# EAGLE design LilyPad-Dev-v34 (EAGLE 6.2)

## Sheet 1 of 2
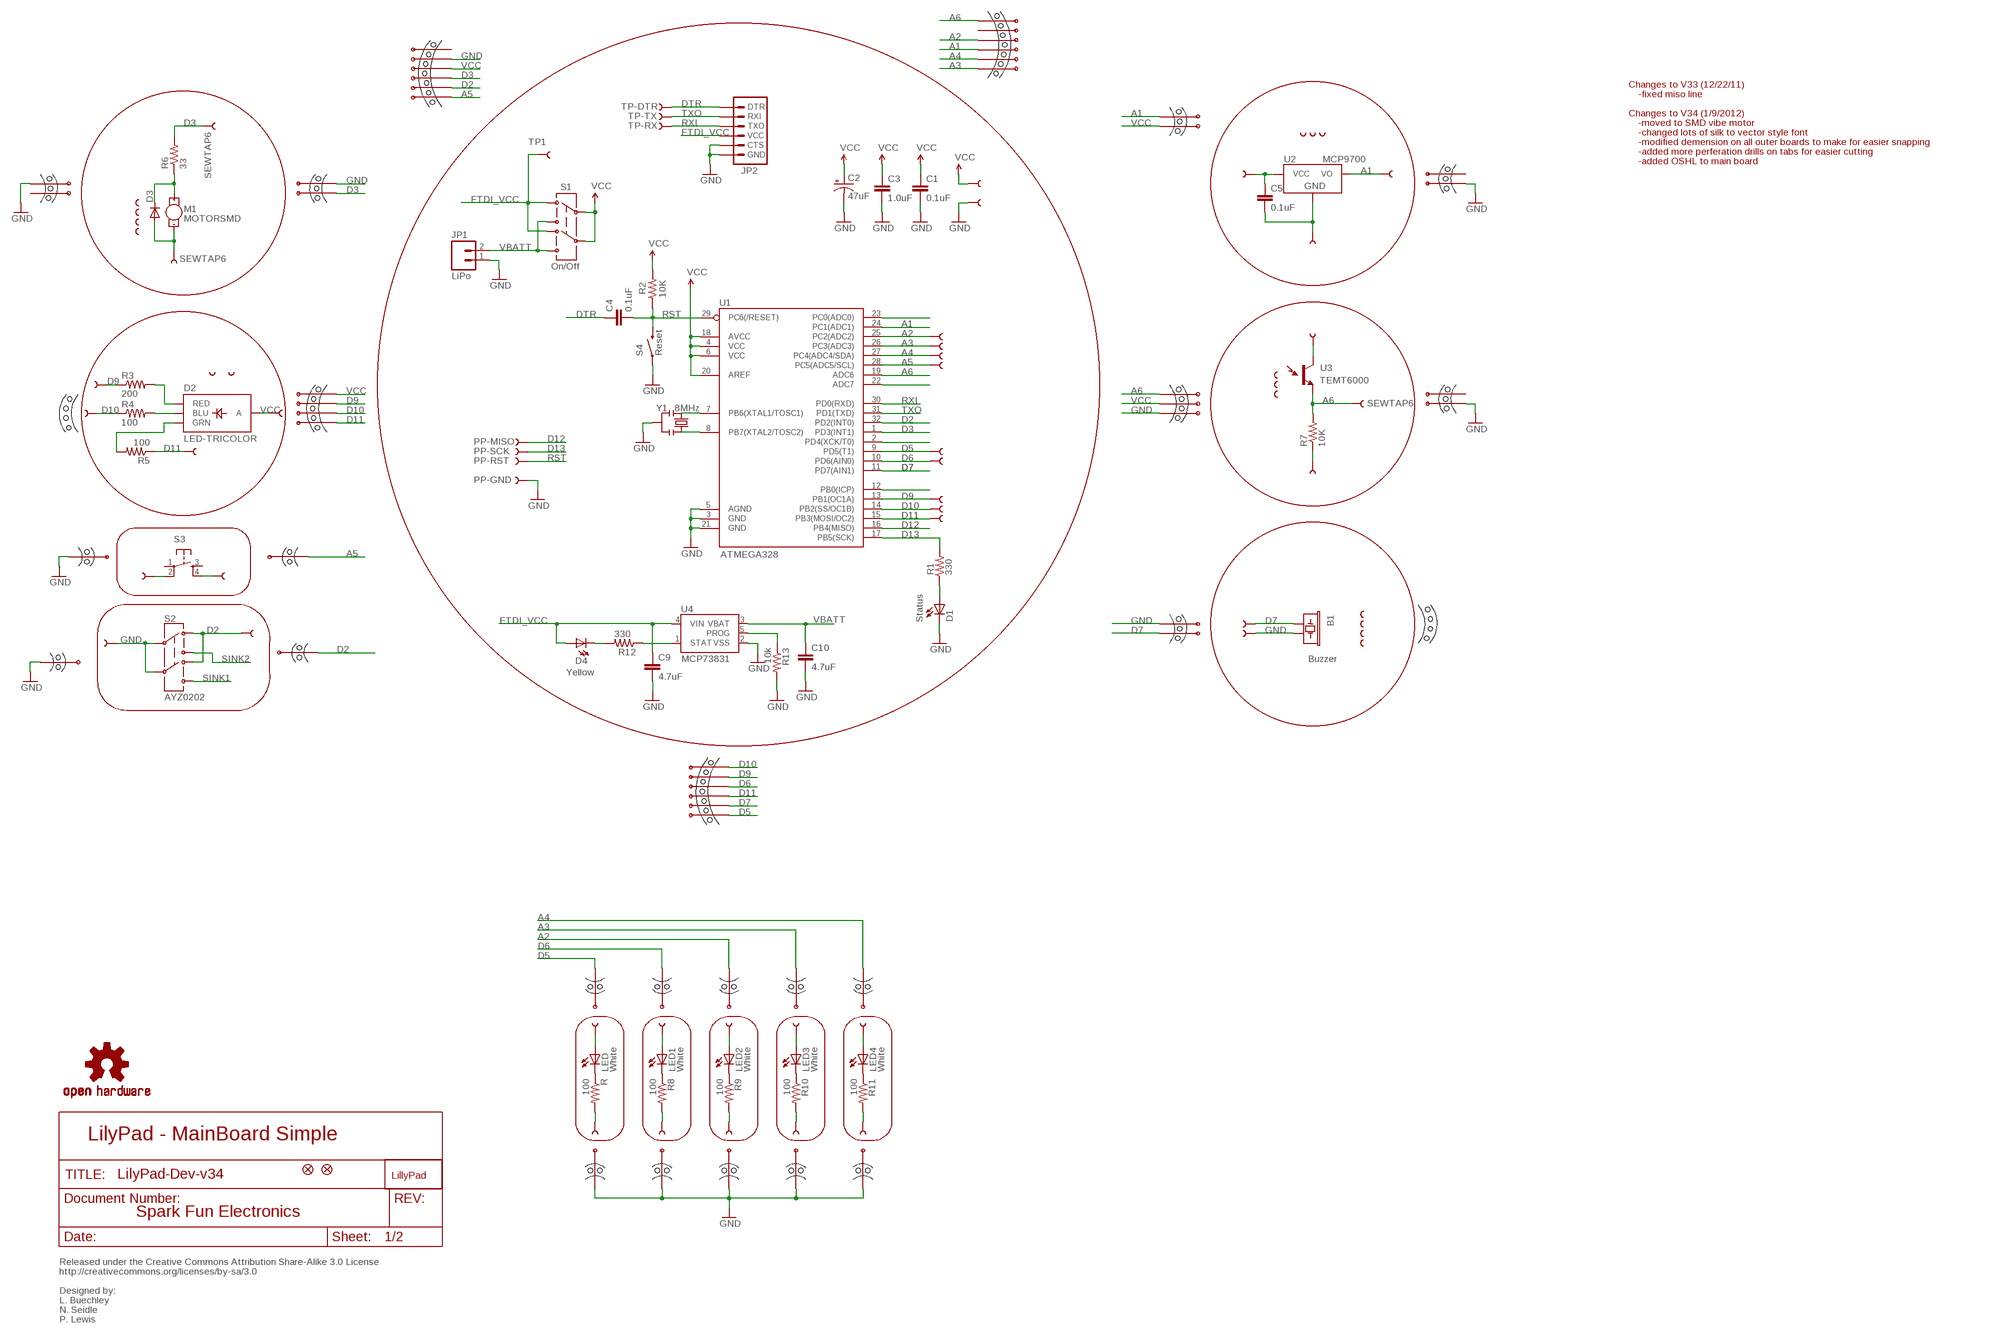
[diagram p0: schematic, sheet 1]

### Parts
1  SEWTAP-NOHOLE2  [PETAL-NOHOLE-2SIDE]
2  SEWTAP-NOHOLE2  [PETAL-NOHOLE-2SIDE]
3  SEWTAP-NOHOLE2  [PETAL-NOHOLE-2SIDE]
4  SEWTAP-NOHOLE2  [PETAL-NOHOLE-2SIDE]
A2/16  SEWTAP9  [PETAL-LONG-1-2SIDE]
A3/17  SEWTAP9  [PETAL-LONG-1-2SIDE]
A4/18  SEWTAP9  [PETAL-LONG-1-2SIDE]
A5/19  SEWTAP9  [PETAL-LONG-1-2SIDE]
B1  Buzzer  BUZZERSMD2  [BUZZER-CCV]
BUTTON-  SEWTAP8  SEWTAP4  [PETAL-SMALL]
BUTTONS  SEWTAP8  SEWTAP4  [PETAL-SMALL]
C1  0.1uF  CAP0402-CAP  [0402-CAP]
C2  47uF  CAP_POL3528  [EIA3528]
C3  1.0uF  CAP0402-CAP  [0402-CAP]
C4  0.1uF  CAP0402-CAP  [0402-CAP]
C5  0.1uF  CAP0603-CAP  [0603-CAP]
C9  4.7uF  CAP0402-CAP  [0402-CAP]
C10  4.7uF  CAP0402-CAP  [0402-CAP]
D1  Status  LED0603  [LED-0603]
D2  LED-TRICOLOR  [LED-TRICOLOR-SMD]
D3  DIODESOD  [SOD-323]
D4  Yellow  LED0603  [LED-0603]
JP1  LiPo  M02-JST-2MM-SMT  [JST-2-SMD]
JP2  ARDUINO_SERIAL_PROGRAMSMD  [1X06-SMD]
JP3  FIDUCIAL1X2  [FIDUCIAL-1X2]
JP4  FIDUCIAL1X2  [FIDUCIAL-1X2]
LED  White  LED1206  [LED-1206]
LED1  White  LED1206  [LED-1206]
LED2  White  LED1206  [LED-1206]
LED3  White  LED1206  [LED-1206]
LED4  White  LED1206  [LED-1206]
LED+  SEWTAP6  [PETAL-SMALL-2SIDE]
LED+1  SEWTAP6  [PETAL-SMALL-2SIDE]
LED+2  SEWTAP6  [PETAL-SMALL-2SIDE]
LED+3  SEWTAP6  [PETAL-SMALL-2SIDE]
LED+4  SEWTAP6  [PETAL-SMALL-2SIDE]
LED-  SEWTAP6  [PETAL-SMALL-2SIDE]
LED-1  SEWTAP6  [PETAL-SMALL-2SIDE]
LED-2  SEWTAP6  [PETAL-SMALL-2SIDE]
LED-3  SEWTAP6  [PETAL-SMALL-2SIDE]
LED-4  SEWTAP6  [PETAL-SMALL-2SIDE]
LIGHT1  SEWTAP-NOHOLE2  [PETAL-NOHOLE-2SIDE]
LIGHT2  SEWTAP-NOHOLE2  [PETAL-NOHOLE-2SIDE]
LIGHT3  SEWTAP-NOHOLE2  [PETAL-NOHOLE-2SIDE]
LIGHT+  SEWTAP6  SEWTAP4  [PETAL-SMALL]
LIGHT-  SEWTAP6  SEWTAP4  [PETAL-SMALL]
LIGHTS  SEWTAP6  SEWTAP4  [PETAL-SMALL]
LOGO  LOGO-LPLPA  [LOGO-LPA]
M1  MOTORSMD  [VIBE-MOTOR-10MM-SMD]
PP-GND  TEST-POINT3X5  [PAD.03X.05]
PP-MISO  TEST-POINT3X5  [PAD.03X.05]
PP-RST  TEST-POINT3X5  [PAD.03X.05]
PP-SCK  TEST-POINT3X5  [PAD.03X.05]
R  100  RESISTOR0603-RES  [0603-RES]
R1  330  RESISTOR0402-RES  [0402-RES]
R2  10K  RESISTOR0402-RES  [0402-RES]
R3  200  RESISTOR0402-RES  [0402-RES]
R4  100  RESISTOR0402-RES  [0402-RES]
R5  100  RESISTOR0402-RES  [0402-RES]
R6  33  RESISTOR0402-RES  [0402-RES]
R7  10K  RESISTOR0402-RES  [0402-RES]
R8  100  RESISTOR0603-RES  [0603-RES]
R9  100  RESISTOR0603-RES  [0603-RES]
R10  100  RESISTOR0603-RES  [0603-RES]
R11  100  RESISTOR0603-RES  [0603-RES]
R12  330  RESISTOR0402-RES  [0402-RES]
R13  10k  RESISTOR0402-RES  [0402-RES]
S1  On/Off  AYZ0202  [AYZ0202]
S2  AYZ0202  [AYZ0202]
S3  TAC_SWITCHSMD  [TACTILE_SWITCH_SMD]
S4  Reset  SWITCH-MOMENTARY-2SMD  [TACTILE_SWITCH_SMD]
SLIDEOFF  SEWTAP8  SEWTAP4  [PETAL-SMALL]
SLIDEON  SEWTAP8  SEWTAP4  [PETAL-SMALL]
TEMP1  SEWTAP-NOHOLE2  [PETAL-NOHOLE-2SIDE]
TEMP2  SEWTAP-NOHOLE2  [PETAL-NOHOLE-2SIDE]
TEMP3  SEWTAP-NOHOLE2  [PETAL-NOHOLE-2SIDE]
TEMP+  SEWTAP6  SEWTAP4  [PETAL-SMALL]
TEMP-  SEWTAP6  SEWTAP4  [PETAL-SMALL]
TEMPS  SEWTAP6  SEWTAP4  [PETAL-SMALL]
TP1  TEST-POINT3X5  [PAD.03X.05]
TP-DTR  TEST-POINT3X5  [PAD.03X.05]
TP-RX  TEST-POINT3X5  [PAD.03X.05]
TP-TX  TEST-POINT3X5  [PAD.03X.05]
U1  ATMEGA328  ATMEGA168  [TQFP32-08]
U2  MCP9700  MCP9700SMD  [SOT23-3]
U3  TEMT6000  [TEMT6000-SEN]
U4  MCP73831  [SOT23-5]
U$1  SEWTAP9  [PETAL-LONG-1-2SIDE]
U$2  MOUSE-BITE-2  [MOUSE-BITE-2]
U$3  MOUSE-BITE-2  [MOUSE-BITE-2]
U$4  SEWTAP9  [PETAL-LONG-1-2SIDE]
U$5  MOUSE-BITE-2  [MOUSE-BITE-2]
U$6  MOUSE-BITE-2  [MOUSE-BITE-2]
U$7  MOUSE-BITE-66  [MOUSE-BITE-6]
U$8  MOUSE-BITE-66  [MOUSE-BITE-6]
U$10  MOUSE-BITE-12_HOLES  [MOUST-BITE-1-(2_HOLES)]
U$11  MOUSE-BITE-12_HOLES  [MOUST-BITE-1-(2_HOLES)]
U$12  MOUSE-BITE-12_HOLES  [MOUST-BITE-1-(2_HOLES)]
U$13  MOUSE-BITE-12_HOLES  [MOUST-BITE-1-(2_HOLES)]
U$14  MOUSE-BITE-12_HOLES  [MOUST-BITE-1-(2_HOLES)]
U$15  MOUSE-BITE-12_HOLES  [MOUST-BITE-1-(2_HOLES)]
U$16  MOUSE-BITE-12_HOLES  [MOUST-BITE-1-(2_HOLES)]
U$17  MOUSE-BITE-12_HOLES  [MOUST-BITE-1-(2_HOLES)]
U$18  MOUSE-BITE-12_HOLES  [MOUST-BITE-1-(2_HOLES)]
U$19  MOUSE-BITE-12_HOLES  [MOUST-BITE-1-(2_HOLES)]
U$20  MOUSE-BITE-4  [MOUSE-BITE-4]
U$22  SEWTAP6  [PETAL-SMALL-2SIDE]
U$23  SEWTAP6  [PETAL-SMALL-2SIDE]
U$24  SEWTAP6  [PETAL-SMALL-2SIDE]
U$25  SEWTAP6  [PETAL-SMALL-2SIDE]
U$26  SEWTAP-NOHOLE2  [PETAL-NOHOLE-2SIDE]
U$27  SEWTAP-NOHOLE2  [PETAL-NOHOLE-2SIDE]
U$32  MOUSE-BITE-2  [MOUSE-BITE-2]
U$32-  SEWTAP6  SEWTAP4  [PETAL-SMALL]
U$33  MOUSE-BITE-3  [MOUSE-BITE-3]
U$33+  SEWTAP6  SEWTAP4  [PETAL-SMALL]
U$37  SEWTAP9  [PETAL-LONG-1-2SIDE]
U$39  SEWTAP9  [PETAL-LONG-1-2SIDE]
U$40  MOUSE-BITE-12_HOLES  [MOUST-BITE-1-(2_HOLES)]
U$41  SEWTAP9  [PETAL-LONG-1-2SIDE]
U$42  MOUSE-BITE-12_HOLES  [MOUST-BITE-1-(2_HOLES)]
U$43  SEWTAP9  [PETAL-LONG-1-2SIDE]
U$44  MOUSE-BITE-12_HOLES  [MOUST-BITE-1-(2_HOLES)]
U$45  SEWTAP9  [PETAL-LONG-1-2SIDE]
U$46  MOUSE-BITE-12_HOLES  [MOUST-BITE-1-(2_HOLES)]
U$47  MOUSE-BITE-2  [MOUSE-BITE-2]
U$48  MOUSE-BITE-3(NO_PADS)  [MOUSE-BITE-3(NO_PADS)]
U$49  MOUSE-BITE-3(NO_PADS)  [MOUSE-BITE-3(NO_PADS)]
U$51  MOUSE-BITE-66  [MOUSE-BITE-6]
U$52  OSHW-LOGOS  [OSHW-LOGO-S]
VIBE1  SEWTAP-NOHOLE2  [PETAL-NOHOLE-2SIDE]
VIBE2  SEWTAP-NOHOLE2  [PETAL-NOHOLE-2SIDE]
VIBE3  SEWTAP-NOHOLE2  [PETAL-NOHOLE-2SIDE]
VIBE4  SEWTAP-NOHOLE2  [PETAL-NOHOLE-2SIDE]
VIBE+  SEWTAP6  SEWTAP4  [PETAL-SMALL]
VIBE-  SEWTAP6  SEWTAP4  [PETAL-SMALL]
Y1  8MHz  RESONATORSMD  [RESONATOR-SMD]

### Nets
A1: TEMPS.1 U1.24(PC1(ADC1)) U2.2(VO) U$2.P$1 U$7.P$4
A2: A2/16.1 U1.25(PC2(ADC2)) U$7.P$3 U$12.P$1
A3: A3/17.1 U1.26(PC3(ADC3)) U$7.P$6 U$13.P$1
A4: A4/18.1 U1.27(PC4(ADC4/SDA)) U$7.P$5 U$14.P$1
A5: A5/19.1 BUTTONS.1 S3.2 U1.28(PC5(ADC5/SCL)) U$8.P$1 U$40.P$1
A6: LIGHTS.1 R7.2 U1.19(ADC6) U3.EMITTER(E1) U$7.P$1 U$33.P$1
BLU: D2.B(BLU) R4.2
D2: S2.3 S2.6 SLIDEON.1 U1.32(PD2(INT0)) U$8.P$2 U$46.P$1
D3: R6.2 U1.1(PD3(INT1)) U$5.P$1 U$8.P$3 VIBE+.1
D5: U1.9(PD5(T1)) U$10.P$1 U$41.1 U$51.P$1
D6: U1.10(PD6(AIN0)) U$1.1 U$11.P$1 U$51.P$4
D7: B1.+ U1.11(PD7(AIN1)) U$32.P$2 U$33+.1 U$51.P$2
D9: R3.1 U1.13(PB1(OC1A)) U$20.P$3 U$22.1 U$37.1 U$51.P$5
D10: R4.1 U1.14(PB2(SS/OC1B)) U$20.P$2 U$24.1 U$39.1 U$51.P$6
D11: R5.1 U1.15(PB3(MOSI/OC2)) U$4.1 U$20.P$1 U$23.1 U$51.P$3
D12: PP-MISO.P$1 U1.16(PB4(MISO))
D13: PP-SCK.P$1 R1.2 U1.17(PB5(SCK))
DTR: C4.1 JP2.1(DTR) TP-DTR.P$1
FTDI_VCC: C9.1 D4.A JP2.4(VCC) S1.3 S1.6 TP1.P$1 U4.4(VIN)
GND [VCC]: B1.- BUTTON-.1 C1.2 C2.C(-) C3.2 C5.2 C9.2 C10.2 D1.C D3.2(A) JP1.1 JP2.5(CTS) JP2.6(GND) LIGHT-.1 M1.P$2(-) PP-GND.P$1 R7.1 R13.2 S2.2 S2.5 S3.4 S4.1 SLIDEOFF.1 TEMP-.1 U1.3(GND) U1.5(AGND) U1.21(GND) U2.3(GND) U4.2(VSS) U$3.P$1 U$5.P$2 U$6.P$1 U$8.P$5 U$15.P$1 U$16.P$1 U$17.P$1 U$18.P$1 U$19.P$1 U$32-.1 U$32.P$1 U$33.P$3 U$42.P$1 U$43.1 U$44.P$1 U$47.P$1 VIBE-.1 Y1.2
GRN: D2.G(GRN) R5.2
N$1: U1.7(PB6(XTAL1/TOSC1)) Y1.1
N$2: D1.A R1.1
N$3: U1.8(PB7(XTAL2/TOSC2)) Y1.3
N$5: U1.23(PC0(ADC0))
N$8: U1.22(ADC7)
N$10: D3.1(C) M1.P$1(+) R6.1
N$12: U1.2(PD4(XCK/T0))
N$14: U1.12(PB0(ICP))
N$18: LED.C R.1
N$19: LED+.1 LED.A
N$20: LED-.1 R.2
N$21: LED1.C R8.1
N$22: LED1.A LED+1.1
N$23: LED-1.1 R8.2
N$24: LED2.C R9.1
N$25: LED2.A LED+2.1
N$26: LED-2.1 R9.2
N$27: LED3.C R10.1
N$28: LED3.A LED+3.1
N$29: LED-3.1 R10.2
N$30: LED4.C R11.1
N$31: LED4.A LED+4.1
N$32: LED-4.1 R11.2
N$33: D4.C R12.2
PROG: R13.1 U4.5(PROG)
RED: D2.R(RED) R3.2
RST: C4.2 PP-RST.P$1 R2.1 S4.3 U1.29(PC6(/RESET))
RXI: JP2.3(TXO) TP-RX.P$1 U1.30(PD0(RXD))
SINK1: S2.4
SINK2: S2.1
STAT: R12.1 U4.1(STAT)
TXO: JP2.2(RXI) TP-TX.P$1 U1.31(PD1(TXD))
VBATT: C10.1 JP1.2 S1.1 S1.4 U4.3(VBAT)
VCC [VCC]: C1.1 C2.A(+) C3.1 C5.1 D2.A LIGHT+.1 R2.2 S1.2 S1.5 TEMP+.1 U1.4(VCC) U1.6(VCC) U1.18(AVCC) U1.20(AREF) U2.1(VCC) U3.COLLECTOR(C1) U$2.P$2 U$8.P$4 U$20.P$4 U$25.1 U$33.P$2 U$45.1
Unconnected: S3.1 S3.3 U$3.P$2 U$6.P$2 U$7.P$2 U$8.P$6 U$47.P$2

### Notes on the sheet
- Changes to V33 (12/22/11)
- -fixed miso line
- Changes to V34 (1/9/2012)
- -moved to SMD vibe motor
- -changed lots of silk to vector style font
- -modified demension on all outer boards to make for easier snapping
- -added more perferation drills on tabs for easier cutting
- -added OSHL to main board
- LilyPad - MainBoard Simple
- Spark Fun Electronics
- Released under the Creative Commons Attribution Share-Alike 3.0 License
- http://creativecommons.org/licenses/by-sa/3.0
- Designed by:
- L. Buechley
- N. Seidle
- P. Lewis

## Sheet 2 of 2
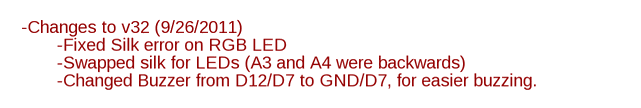
[diagram p1: schematic, sheet 2]

### Notes on the sheet
- -Changes to v32 (9/26/2011)
- -Fixed Silk error on RGB LED
- -Swapped silk for LEDs (A3 and A4 were backwards)
- -Changed Buzzer from D12/D7 to GND/D7, for easier buzzing.

## Library data of the parts
1-4 LIGHT1-LIGHT3 TEMP1-TEMP3 U$26 U$27 VIBE1-VIBE4 = LilyPad-Wearables:SEWTAP-NOHOLE
A2/16 A3/17 A4/18 A5/19 BUTTON- BUTTONS LED+ LED+1-LED+4 LED- LED-1-LED-4 LIGHT+ LIGHT- LIGHTS SLIDEOFF SLIDEON TEMP+ TEMP- TEMPS U$1 U$4 U$22-U$25 U$32- U$33+ U$37 U$39 U$41 U$43 U$45 VIBE+ VIBE- = LilyPad-Wearables:SEWTAP
B1 = SparkFun:BUZZER: Buzzer 12mm Spark Fun Electronics SKU : Comp-Buzzer
C1 C3-C5 C9 C10 = SparkFun:CAP: Capacitor Standard 0603 ceramic capacitor, and 0.1" leaded capacitor.
C2 = SparkFun:CAP_POL: Capacitor Polarized These are standard SMD and PTH capacitors. Normally 10uF, 47uF, and 100uF in electrolytic and tantalum varieties. Always verify the external diameter of the through hole cap, it varies with capacity, voltage, and manufacturer. The EIA devices should be standard.
D1 D4 = SparkFun:LED: LEDs
D2 = SparkFun:LED-TRICOLOR: Tri-Color LED SMD Proven layout and schematic for triple color LED in SMD package - common anode. Spark Fun Electronics SKU : COM-07844
D3 = SparkFun:DIODE: Diode These are standard reverse protection diodes and small signal diodes. SMA package can handle up to about 1A. SOD-323 can handle about 200mA. What the SOD-323 package when ordering, there are some mfgs out there that are 5-pin packages.
JP1 = SparkFun:M02: Header 2 Standard 2-pin 0.1" header. Use with straight break away headers (SKU : PRT-00116), right angle break away headers (PRT-00553), swiss pins (PRT-00743), machine pins (PRT-00117), and female headers (PRT-00115). Molex polarized connector foot print use with SKU : PRT-08233 with associated crimp pins and housings.
JP2 = SparkFun:ARDUINO_SERIAL_PROGRAM
JP3 JP4 = SparkFun:FIDUCIAL: Fiducial Alignment Points Various fiducial points for machine vision alignment.
LED LED1-LED4 = SparkFun-3-2-07:LED: LEDs
LOGO = LilyPad-Wearables:LOGO-LP
M1 = Testing:MOTOR: Vibration Motor Physical dimension and wire connections for this powerful vibration motor. Motor has a self adhesive backing. Spark Fun Electronics SKU : ROB-08449
PP-GND PP-MISO PP-RST PP-SCK TP1 TP-DTR TP-RX TP-TX = SparkFun:TEST-POINT
R R1-R13 = SparkFun:RESISTOR: Resistor Basic schematic elements and footprints for 0603, 1206, and PTH resistors.
S1 S2 = SparkFun:AYZ0202: SPDT Slide Switch Simple SMD single-pull double-throw slide switch. Good for less than 350mA power switch, switching UARTs between devices, etc. Spark Fun Electronics SKU : COM-00597
S3 = SparkFun:TAC_SWITCH: Momentary Switch Button commonly used for reset or general input. Spark Fun Electronics SKU : COM-00097
S4 = SparkFun:SWITCH-MOMENTARY-2
U1 = SparkFun:ATMEGA168
U2 = SparkFun:MCP9700
U3 = SparkFun:TEMT6000: Ambient Light Sensor Simple light detection sensor. Output varies with light intensity input. Spark Fun Electronics SKU : COM-08348
U4 = SparkFun:MCP73831: Microchip's MCP73831 Miniature single cell, fully integrated Li-Ion, Li-polymer charge management controller http://ww1.microchip.com/downloads/en/DeviceDoc/21984a.pdf
U$2 U$3 U$5 U$6 U$32 U$47 = Testing:MOUSE-BITE-2
U$7 U$8 U$51 = Testing:MOUSE-BITE-6
U$10-U$19 U$40 U$42 U$44 U$46 = Testing:MOUSE-BITE-1
U$20 = Testing:MOUSE-BITE-4
U$33 = Testing:MOUSE-BITE-3
U$48 U$49 = Testing:MOUSE-BITE-3(NO_PADS)
U$52 = SparkFun:OSHW-LOGO: Open Source Hardware Logo This logo indicates the piece of hardware it is found on incorporates a OSHW license and/or adheres to the definition of open source hardware found here: http://freedomdefined.org/OSHW
Y1 = SparkFun:RESONATOR: Resonator Small SMD resonator. This is the itty bitty 10/20MHz resonators with built in caps. CSTCE10M0G55 and CSTCE20M0V53. Footprint has been reviewed closely but hasn't been tested yet.

## Net classes
1 VCC: width 0.203 mm

## Board
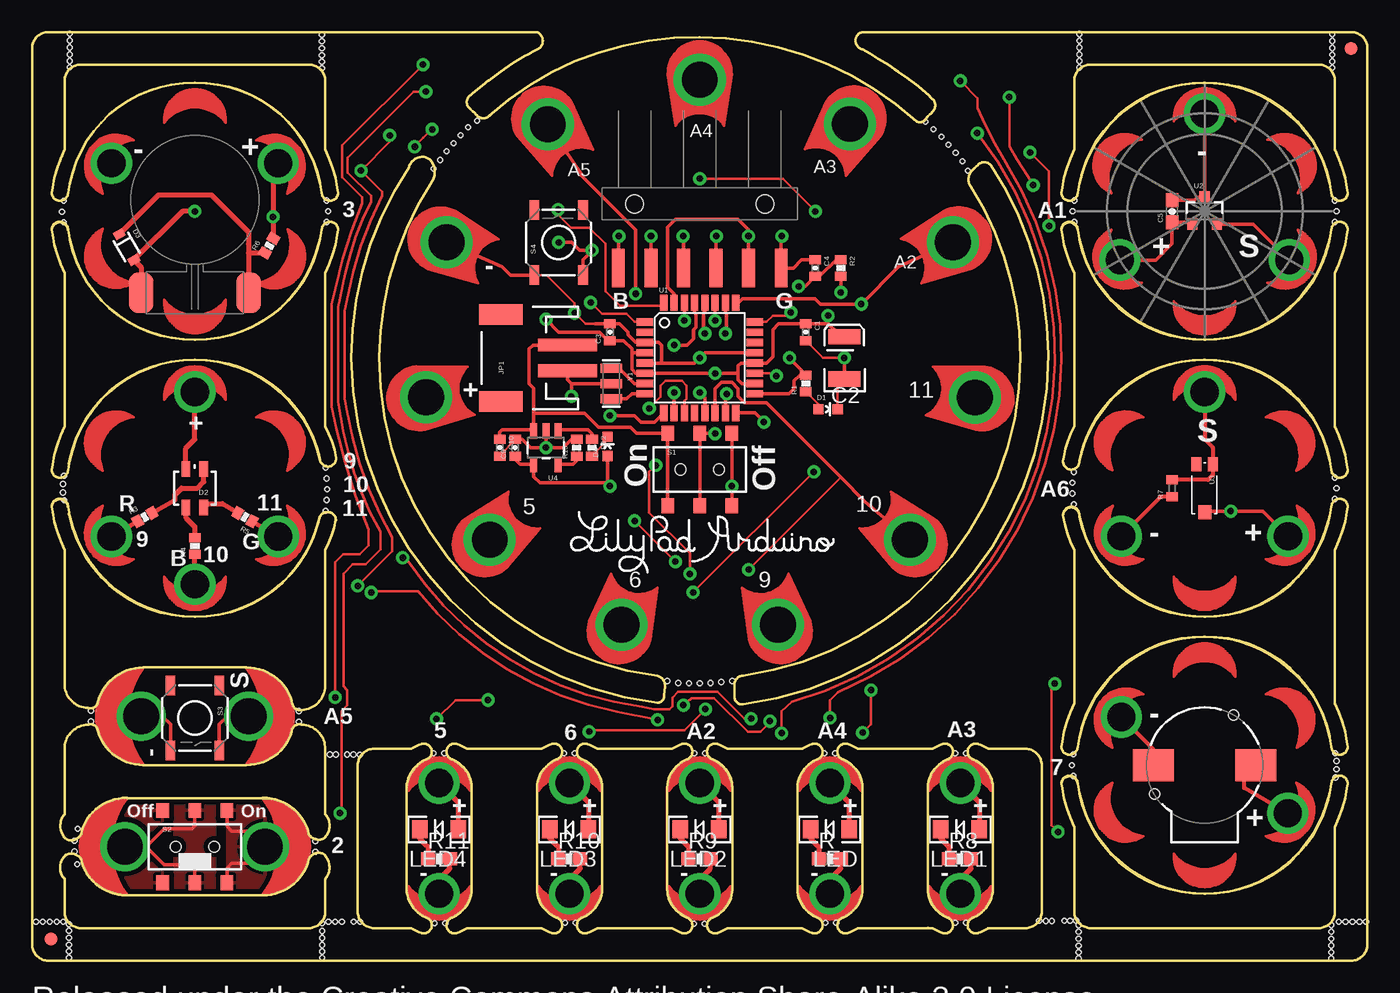
[diagram p2: board, top side]
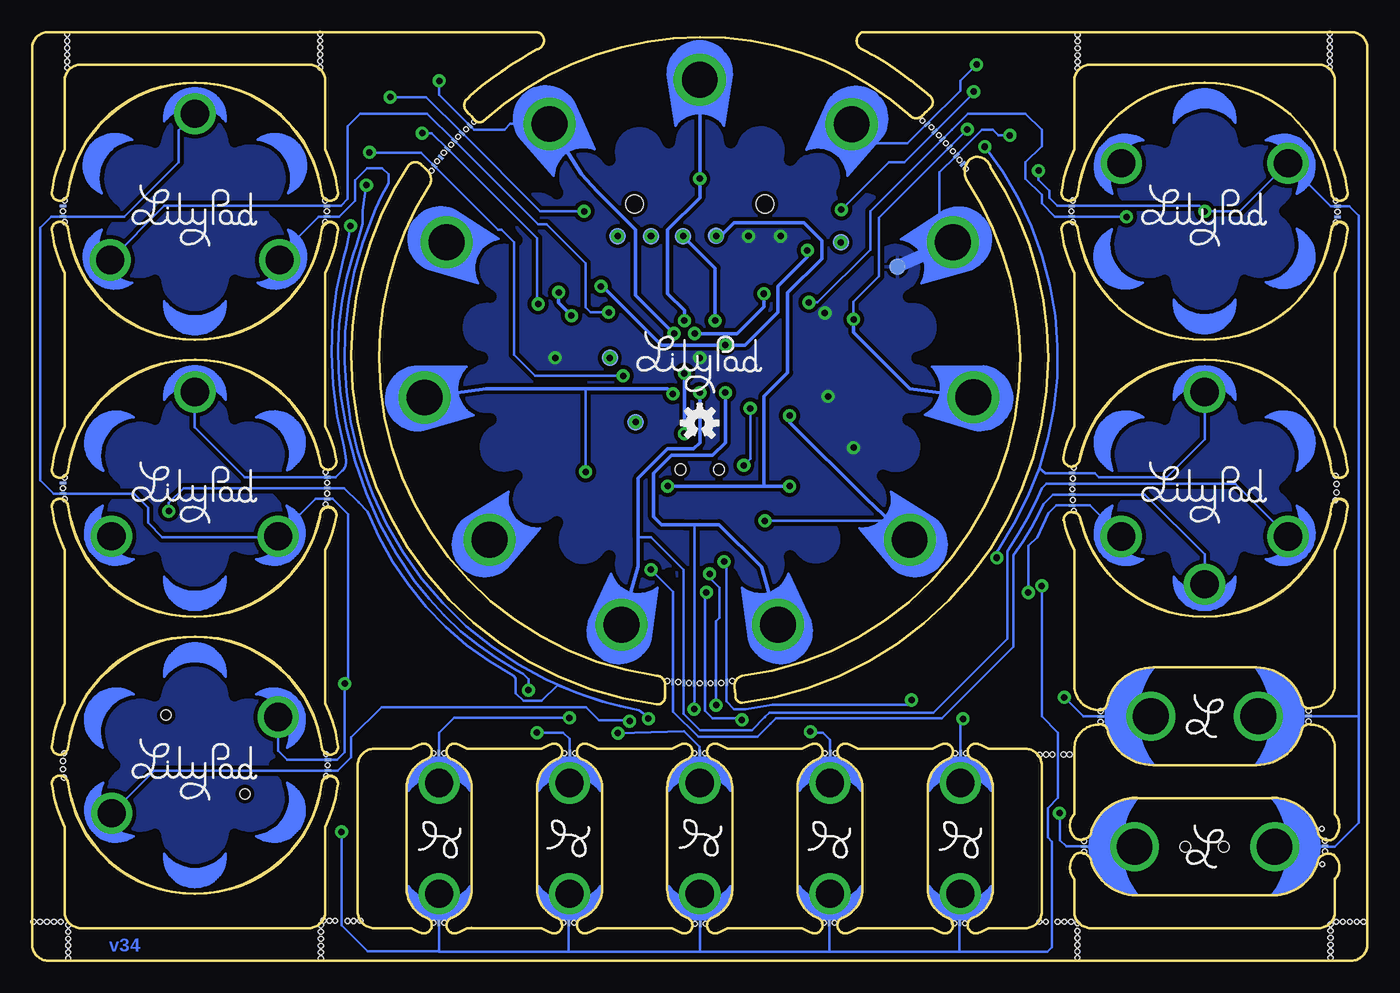
[diagram p3: board, bottom side, seen from below]

Size 104.14 x 72.39 mm. Coordinates in mm from the lower left corner, seen from the top.
Outline: 543 segments
Copper layers (1*16): Top 0.035mm / dielectric 1.5mm / Bottom 0.035mm
Design rules: minimum track width 6mil, minimum drill 15mil, track to track 8mil, track to pad 8mil, pad to pad 8mil, via to via 8mil, smd to smd 8mil, copper to edge 10mil, drill to drill 8mil, minimum pad ring 12mil, minimum via ring 10mil, stop-mask expansion 4mil, vias tented up to drill 20mil, thermal gap 10mil
Holes 0.38 mm at 3.56,10.29 3.53,7.52 2.89,2.85 2.89,2.33 2.89,1.79 2.89,1.24 2.89,0.74 2.89,0.24 22.62,2.91 22.63,2.31 22.63,1.77 22.63,1.22 22.63,0.71 22.63,0.22 2.94,72.25 2.94,71.73 2.94,71.19 2.94,70.64 2.94,70.14 2.94,69.64 22.61,72.19 22.61,71.67 22.61,71.13 22.61,70.58 22.61,70.07 22.61,69.58 81.62,2.77 81.62,2.25 81.62,1.71 81.62,1.17 81.62,0.66 81.62,0.16 101.32,2.78 101.32,2.26 101.32,1.72 101.32,1.18 101.32,0.67 101.32,0.17 81.68,72.25 81.68,71.72 81.68,71.18 81.68,70.64 81.68,70.13 81.68,69.63 101.39,72.21 101.39,71.69 101.39,71.15 101.39,70.61 101.39,70.1 101.39,69.6 25.58,3.03 25.08,3.02 24.17,3.02 23.64,3.03 23.11,3.04 81.41,3.14 80.96,3.12 80.49,3.11 79.06,3.09 78.54,3.11 79.53,3.1 102.44,3.04 102.98,3.04 103.52,3.04 104.03,3.04 101.91,3.04 0.84,3.04 1.38,3.04 1.92,3.04 2.43,3.04 0.31,3.04 25.57,16.06 25.05,16.07 25.05,16.07 24.58,16.07 23.69,16.08 23.22,16.07
bRestrict: area 29.5,24.4 to 74.6,69.6; area 48.1,64.8 to 50.6,66; area 58.7,63.3 to 61.5,65; area 63.4,60.4 to 66,62.7; area 67.1,56.1 to 69.1,58.9; area 69.3,51.2 to 70.7,53.8; area 69.9,45.9 to 71.1,48.2; area 69.3,40.2 to 70.8,42.9; area 63.4,31.4 to 66.1,33.7; area 58.8,29 to 61.6,30.7; area 53.6,28 to 56,29.3; area 48.2,28 to 50.7,29.3; 11 more areas; 22 lines

### Footprints (pad centres in the part's own frame; a part is rotated, then mirrored left to right if it is on the bottom)
PETAL-LONG-1-2SIDE = drill 2.794 pad 4.064: 1 0.03,0
BUZZER-CCV = smd 3.2 x 2.5: + 4,0; - -4,0 | hole 0.8: -3.9,-2.25; 2.25,3.9
PETAL-MEDIUM-2SIDE = drill 2.794: 1 0,-0.254
0402-CAP = smd 0.7 x 0.9: 1 -0.65,0; 2 0.65,0
EIA3528 = smd 1.2 x 2.5: A 1.65,0; C -1.65,0
0603-CAP = smd 1.1 x 1: 1 -0.85,0; 2 0.85,0
LED-0603 = smd 0.8 x 0.8: A 0,-0.75; C 0,0.75
LED-TRICOLOR-SMD = smd 0.7 x 1.2: A 0.7,-1.5; B 0.7,1.5; G -0.7,1.5; R -0.7,-1.5
SOD-323 = smd 0.63 x 0.83: 1 -1.15,0; 2 1.15,0
JST-2-SMD = smd 1 x 4.6: 1 -1,-3.7; 2 1,-3.7 | smd 1.6 x 3.4: NC1 -3.4,1.5; NC2 3.4,1.5
1X06-SMD = smd 1 x 3: 1 -6.35,5; 2 -3.81,5; 3 -1.27,5; 4 1.27,5; 5 3.81,5; 6 6.35,5 | hole 1.4: -5.08,0; 5.08,0
FIDUCIAL-1X2 = smd 1 x 1: 1 0,0
LED-1206 = smd 1.2 x 1.4: A -1.5,0; C 1.5,0
PETAL-SMALL-2SIDE = drill 2.2: 1 0,0
VIBE-MOTOR-10MM-SMD = smd 1.905 x 3.175: P$1 4.191,-7.239; P$2 -4.191,-7.239
PAD.03X.05 = smd 1.27 x 1.27: P$1 0,0
0603-RES = smd 1.1 x 1: 1 -0.85,0; 2 0.85,0
0402-RES = smd 0.7 x 0.9: 1 -0.65,0; 2 0.65,0
C0402 = smd 0.7 x 0.9: 1 -0.65,0; 2 0.65,0
AYZ0202 = smd 1 x 1.15: 1 -2.5,2.825; 2 0,2.825; 3 2.5,2.825; 4 -2.5,-2.825; 5 0,-2.825; 6 2.5,-2.825 | hole 0.85: 1.5,0; -1.5,0
TACTILE_SWITCH_SMD = smd 1.524 x 0.762: 1 -2.54,1.905; 2 2.54,1.905; 3 -2.54,-1.905; 4 2.54,-1.905
TQFP32-08 = smd 1.27 x 0.559: 1 -4.293,2.8; 2 -4.293,2; 3 -4.293,1.2; 4 -4.293,0.4; 5 -4.293,-0.4; 6 -4.293,-1.2; 7 -4.293,-2; 8 -4.293,-2.8; 17 4.293,-2.8; 18 4.293,-2; 19 4.293,-1.2; 20 4.293,-0.4; 21 4.293,0.4; 22 4.293,1.2; 23 4.293,2; 24 4.293,2.8 | smd 0.559 x 1.27: 9 -2.8,-4.293; 10 -2,-4.293; 11 -1.2,-4.293; 12 -0.4,-4.293; 13 0.4,-4.293; 14 1.2,-4.293; 15 2,-4.293; 16 2.8,-4.293; 25 2.8,4.293; 26 2,4.293; 27 1.2,4.293; 28 0.4,4.293; 29 -0.4,4.293; 30 -1.2,4.293; 31 -2,4.293; 32 -2.8,4.293
SOT23-3 = smd 0.8 x 0.9: 1 -0.95,-1; 2 0.95,-1; 3 0,1.1
TEMT6000-SEN = smd 1.1 x 0.8: BASE -1.87,-0.65; EMITTER -1.87,0.65 | smd 1.1 x 1: COLLECTOR 1.86,0.01
SOT23-5 = smd 0.55 x 1.2: 1 -0.95,-1.3; 2 0,-1.3; 3 0.95,-1.3; 4 0.95,1.3; 5 -0.95,1.3
MOUSE-BITE-2 = smd 0.203 x 0.508 bottom: P$1 -0.419,0; P$2 0.419,0 | hole 0.381: -0.838,0.127; 0,0; 0.838,0.127
MOUSE-BITE-6 = smd 0.203 x 0.508 bottom: P$1 -2.095,0.089; P$2 -1.257,0.038; P$3 -0.419,0; P$4 0.419,0; P$5 1.257,0.038; P$6 2.095,0.114 | hole 0.381: -2.527,0.191; -1.676,0.025; -0.838,0; 0,0; 0.838,0.025; 1.676,0.102; 2.527,0.191
MOUST-BITE-1-(2_HOLES) = smd 0.203 x 0.508 bottom: P$1 -0.013,0 | hole 0.381: -0.432,0; 0.406,0
MOUSE-BITE-4 = smd 0.203 x 0.508 bottom: P$1 -1.257,0; P$2 -0.419,0; P$3 0.419,0; P$4 1.257,0 | hole 0.381: -1.676,0.127; -0.838,0.051; 0,0; 0.838,0.051; 1.676,0.127
MOUSE-BITE-3 = smd 0.203 x 0.508 bottom: P$1 -0.851,0; P$2 -0.013,0; P$3 0.826,0 | hole 0.381: -1.27,0.127; -0.432,0; 0.406,0; 1.245,0.127
MOUSE-BITE-3(NO_PADS) = hole 0.381: -0.965,0.076; -0.33,0; 0.33,0; 0.94,0.102
RESONATOR-SMD = smd 0.7 x 1.7: 1 -1.2,0; 2 0,0; 3 1.2,0

### Placement (x,y rotation side)
1  91.44,22.74 180 top
2  97.94,18.99 120 top
3  91.44,7.74 0 top
4  84.94,11.49 300 top
A2/16  71.84,56.03 204.5 top
A3/17  63.81,65.25 237.3 top
A4/18  52.07,68.69 270 top
A5/19  40.2,65.23 302.7 top
B1  91.44,15.24 0 top
BUTTON-  SEWTAP8  [PETAL-MEDIUM-2SIDE]  8.76,19.05 270 top
BUTTONS  SEWTAP8  [PETAL-MEDIUM-2SIDE]  16.64,19.05 90 top
C1  60.34,48.99 270 top
C2  63.34,46.99 90 top
C3  45.07,48.99 90 top
C4  61.07,53.99 270 top
C5  88.9,58.42 90 top
C9  37.67,39.99 90 top
C10  36.47,39.99 270 top
D1  62.07,42.99 270 top
D2  12.7,36.83 180 top
D3  7.37,55.63 300 top
D4  44.87,40.09 0 top
JP1  38.07,46.99 90 top
JP2  52.07,58.99 180 top
JP3  102.87,71.12 0 top
JP4  1.47,1.68 0 top
LED  62.21,10.24 180 top
LED1  72.37,10.24 180 top
LED2  52.05,10.24 180 top
LED3  41.89,10.24 180 top
LED4  31.73,10.24 180 top
LED+  62.23,13.84 180 top
LED+1  72.39,13.84 180 top
LED+2  52.07,13.84 180 top
LED+3  41.91,13.84 180 top
LED+4  31.75,13.84 180 top
LED-  62.23,5.21 0 top
LED-1  72.39,5.21 0 top
LED-2  52.07,5.21 0 top
LED-3  41.91,5.21 0 top
LED-4  31.75,5.21 0 top
LIGHT1  84.94,40.59 240 top
LIGHT2  91.44,29.34 0 top
LIGHT3  97.93,40.58 120 top
LIGHT+  SEWTAP6  [PETAL-SMALL-2SIDE]  97.94,33.08 60 top
LIGHT-  SEWTAP6  [PETAL-SMALL-2SIDE]  84.95,33.08 300 top
LIGHTS  SEWTAP6  [PETAL-SMALL-2SIDE]  91.44,44.33 180 top
LOGO  52.07,32.99 0 top
LOGO1  LOGO-LPL  [LOGO-L]  12.7,8.89 0 bottom
LOGO2  LOGO-LPL  [LOGO-L]  12.7,19.05 0 bottom
LOGO3  LOGO-LPL  [LOGO-L]  62.31,9.53 90 bottom
LOGO4  LOGO-LPL  [LOGO-L]  72.34,9.42 90 bottom
LOGO5  LOGO-LPL  [LOGO-L]  51.99,9.58 90 bottom
LOGO6  LOGO-LPL  [LOGO-L]  41.94,9.42 90 bottom
LOGO7  LOGO-LPL  [LOGO-L]  31.72,9.42 90 bottom
M1  12.7,59.31 0 top
PP-GND  36.67,54.09 0 bottom
PP-MISO  57.07,41.99 0 bottom
PP-RST  41.07,55.99 0 bottom
PP-SCK  59.07,46.99 0 bottom
R  62.21,7.95 0 top
R1  60.34,44.99 90 top
R2  63.07,53.99 270 top
R3  8.8,34.58 30 top
R4  12.7,32.33 90 top
R5  16.6,34.58 150 top
R6  18.5,55.74 60 top
R7  10K  [C0402]  88.9,36.83 90 top
R8  72.37,7.95 0 top
R9  52.05,7.95 0 top
R10  41.89,7.95 0 top
R11  31.73,7.95 0 top
R12  43.67,39.99 270 top
R13  42.47,39.99 90 top
S1  52.07,38.29 0 top
S2  12.7,8.89 0 top
S3  12.7,18.92 270 top
S4  41.07,55.99 90 top
SLIDEOFF  SEWTAP8  [PETAL-MEDIUM-2SIDE]  7.49,8.89 270 top
SLIDEON  SEWTAP8  [PETAL-MEDIUM-2SIDE]  17.91,8.89 90 top
TEMP1  84.84,62.22 240 top
TEMP2  91.44,50.82 0 top
TEMP3  98.04,62.22 120 top
TEMP+  SEWTAP6  [PETAL-SMALL-2SIDE]  84.84,54.62 300 top
TEMP-  SEWTAP6  [PETAL-SMALL-2SIDE]  91.44,66.02 180 top
TEMPS  SEWTAP6  [PETAL-SMALL-2SIDE]  98.04,54.62 60 top
TP1  50.8,56.52 0 bottom
TP-DTR  58.47,56.49 0 bottom
TP-RX  53.37,56.49 0 bottom
TP-TX  55.87,56.49 90 bottom
U1  52.07,46.99 0 top
U2  91.44,58.42 0 top
U3  91.44,36.83 270 top
U4  40.07,39.99 180 top
U$1  45.96,26.16 73.7 top
U$2  81.15,58.42 270 top
U$3  101.73,58.42 90 top
U$4  73.55,43.9 171.8 top
U$5  23.09,58.42 90 top
U$6  101.73,36.83 90 top
U$7  71.47,63.6 131 top
U$8  32.87,63.73 228 top
U$9  [LOGO-LILYPAD]  12.7,36.83 0 bottom
U$10  31.75,16.18 0 top
U$11  41.88,16.18 180 top
U$12  52.04,16.18 180 top
U$13  72.39,16.18 180 top
U$14  62.2,16.18 180 top
U$15  31.83,2.92 0 top
U$16  41.99,2.95 0 top
U$17  52.04,2.87 0 top
U$18  72.42,2.95 0 top
U$19  62.31,2.95 0 top
U$20  23.01,36.75 90 top
U$21  LOGO-LPLP  [LOGO-LILYPAD]  52.07,46.99 0 bottom
U$22  6.2,33.07 300 top
U$23  19.2,33.07 60 top
U$24  12.7,29.34 0 top
U$25  12.7,44.32 180 top
U$26  19.2,40.59 120 top
U$27  6.2,40.59 240 top
U$28  [LILYPAD-BRD-LAYERS-SMALL]  91.44,58.42 0 top
U$29  LOGO-LPLP  [LOGO-LILYPAD]  12.7,58.42 0 bottom
U$30  LOGO-LPLP  [LOGO-LILYPAD]  91.44,58.42 0 bottom
U$31  LOGO-LPLP  [LOGO-LILYPAD]  91.44,36.83 0 bottom
U$32  81.08,15.24 270 top
U$32-  SEWTAP6  [PETAL-SMALL-2SIDE]  84.94,18.99 240 top
U$33  81.13,36.83 270 top
U$33+  SEWTAP6  [PETAL-SMALL-2SIDE]  97.93,11.49 60 top
U$34  [LILYPAD-BRD-LAYERS-SMALL]  91.44,36.83 0 top
U$35  LOGO-LPLP  [LOGO-LILYPAD]  91.44,15.24 0 bottom
U$36  [LILYPAD-BRD-LAYERS-SMALL]  91.44,15.24 0 top
U$37  58.18,26.16 106.3 top
U$38  [LILYPAD-BRD-LAYERS-SMALL]  12.7,36.83 0 top
U$39  68.47,32.78 139.1 top
U$40  20.8,19.05 90 top
U$41  35.67,32.78 40.9 top
U$42  4.6,19.05 270 top
U$43  32.3,56.02 335.5 top
U$44  3.3,8.92 270 top
U$45  30.69,43.91 8.2 top
U$46  22.1,8.92 90 top
U$47  2.34,58.39 270 top
U$48  2.41,36.83 270 top
U$49  101.73,15.24 90 top
U$50  [LILYPAD-BRD-LAYERS-SMALL]  12.7,58.42 0 top
U$51  52.07,21.62 0 top
U$52  52.07,41.91 0 bottom
VIBE1  6.2,54.67 300 top
VIBE2  12.7,50.92 0 top
VIBE3  19.23,54.62 60 top
VIBE4  12.7,65.92 180 top
VIBE+  SEWTAP6  [PETAL-SMALL-2SIDE]  19.2,62.17 120 top
VIBE-  SEWTAP6  [PETAL-SMALL-2SIDE]  6.2,62.17 240 top
Y1  45.17,44.99 270 top

### Tracks (layer width: path | path; a pad name or v marks a point on that pad's centre or on a via)
A1  (via drill 0.51)
  Top 0.203: U1.24 57.28,49.79 57.78,50.29 58.93,50.29 v59.18,50.55
  Top 0.254: 92.44,57.42 95.24,57.42 TEMPS.1
  Top 0.406: 92.44,57.42 U2.2
  Bottom 0.203: v59.18,50.55 60.58,50.55 60.96,50.93 60.96,54.36 64.01,57.4 64.68,57.4 U$7.P$4 73.32,66.04 78.54,66.04 79.52,65.07 79.52,59.38 80.05,58.85 80.52,58.85 U$2.P$1 93.82,58.84 TEMPS.1
A2  (via drill 0.51)
  Top 0.203: v73.71,64.52 arc-113 59.26,20.19 58.45,19.46 v58.45,17.73
  Top 0.254: A2/16.1 67.57,54.09 v64.67,51.19 61.48,51.19 61.06,51.61 55.38,51.61 54.96,51.19 U1.25
  Bottom 0.203: v64.67,51.19 64.77,51.29 64.77,56.33 U$7.P$3 72.98,64.52 v73.71,64.52 | 52.06,15.71 U$12.P$1 52.07,16.19 52.08,16.68 53.3,17.9 v58.45,17.73
A3  (via drill 0.51)
  Top 0.203: v72.39,68.58 73.74,67.23 73.74,66.5 arc10 75.79,62.46 arc-100 62.87,20.93 62.23,20.3 v62.23,18.92
  Top 0.254: U1.26 54.07,50.49 54.17,50.39 54.17,48.99 v54.07,48.89
  Bottom 0.203: A3/17.1 66.86,65.22 67.31,64.77 69.67,64.77 U$7.P$6 72.39,67.49 v72.39,68.58 | U$13.P$1 72.4,17.77 71.25,18.92 v62.23,18.92
  Bottom 0.254: A3/17.1 61.27,61.29 60.07,59.99 57.07,56.99 57.07,51.89 v54.07,48.89
A4  (via drill 0.51)
  Top 0.203: v61.09,58.42 58.55,60.96 v52.07,60.96 | v76.2,67.31 76.2,63.5 76.81,62.46 arc-3 v78.07,60.46 | v65.43,21.08 65.43,18.44 v64.77,17.78
  Top 0.254: v53.27,49.89 U1.27
  Bottom 0.203: v61.09,58.42 64.51,58.42 U$7.P$5 73.4,67.31 v76.2,67.31 | v65.43,21.08 65.43,21.95 65.86,22.38 66.37,22.66 arc25 74.3,29.59 arc29 80.06,44.07 arc25 79.1,55.02 arc-2 78.37,57.43 78.37,58.46 v78.07,60.46 | v64.77,17.78 62.71,17.78 62.22,17.29 U$14.P$1
  Bottom 0.254: v53.27,49.89 53.27,50.69 54.57,51.99 54.57,56.99 52.07,59.49 v52.07,60.96 A4/18.1
A5  (via drill 0.51)
  Top 0.203: v23.65,20.52 23.65,31.06 24.25,31.66 25.54,31.66 26.27,32.39 26.27,33.6 arc-11 23.73,41.53 23.37,43.18 23.37,51.18 23.66,52.48 arc-10 25.76,59.03 25.76,59.52 24.2,61.08 24.2,63.57 v30.48,69.85
  Top 0.254: A5/19.1 42.87,61.29 42.87,61.19 47.07,56.99 v47.07,51.99 | U1.28 52.47,50.59 52.37,50.49 52.37,48.99 v52.47,48.89 | S3.2 14.61,18.41 15.24,19.05 BUTTONS.1
  Bottom 0.203: 16.89,19.04 BUTTONS.1 16.9,19.04 U$40.P$1 22.16,19.04 v23.65,20.52 | A5/19.1 38.72,63.7 35.86,63.7 U$8.P$1 31.75,67.81 31.75,68.58 v30.48,69.85
  Bottom 0.254: v47.07,51.99 47.07,50.99 49.17,48.89 v52.47,48.89
A6  (via drill 0.51)
  Top 0.203: U1.19 57.84,45.79 v58.04,45.59 | v79.31,57.28 79.31,61.54 v77.83,63.02
  Top 0.305: LIGHTS.1 91.44,40.64 92.08,40.01 92.08,38.69 | 92.08,38.69 92.08,38.61 | 92.08,38.69 U3.EMITTER 92.09,37.86 91.71,37.48 R7.2
  Bottom 0.203: v58.04,45.59 64.9,45.59 66.55,47.24 66.55,56.01 67.54,57 67.81,57 U$7.P$1 73.78,62.97 77.78,62.97 v77.83,63.02 | U$33.P$1 81.19,37.68 | U$33.P$1 80.45,37.68 79.96,38.18 arc-64 79.7,39.27 79.81,40.01 arc29 79.86,54.79 arc-11 v79.31,57.28 | U$33.P$1 87.55,37.68 91.44,41.57 LIGHTS.1
BLU
  Top 0.406: D2.B 12,34.53 12.7,33.83 R4.2 12.75,32.93
D2  (via drill 0.51)
  Top 0.203: U1.32 49.04,51.05 45.85,51.05 44.7,52.2 44.7,55.88 43.43,57.15 42.04,57.15 41.02,58.17 v41.02,58.55 | v30.71,67.74 29.77,67.74 24.61,62.59 24.61,61.44 26.43,59.63 26.43,59.17 arc15 24.43,53.54 23.88,50.93 23.88,43.56 24.28,41.32 arc20 27.16,33.42 27.16,32.05 26.01,30.9 25.01,30.9 24.28,30.18 24.28,21.39 24.59,21.08 24.59,19.91 24.13,19.46 24.13,11.61 v24.02,11.5
  Top 0.254: S2.3 15.2,10.46 15.57,10.09 16.98,10.09 16.98,10.07 SLIDEON.1 16.86,7.59 15.57,7.59 15.2,7.22 S2.6
  Bottom 0.203: SLIDEON.1 22.09,8.89 U$46.P$1 23.48,8.9 23.98,9.4 23.98,11.46 v24.02,11.5 | v41.02,58.55 37.31,62.26 36.12,62.26 U$8.P$2 30.71,67.67 v30.71,67.74
  pour Top (isolate 0.381): 15.24,5.08 17.4,5.08 18.03,6.22 18.41,7.37 18.67,8.26 18.67,9.78 18.29,10.92 17.65,12.06 17.27,12.7 15.24,12.7
D3  (via drill 0.51)
  Top 0.203: U1.1 46.98,49.79 46.35,50.42 44.45,50.42 v43.56,51.31 | R6.2 18.82,57.95 v18.79,57.99
  Top 0.406: R6.2 18.82,61.8 VIBE+.1
  Bottom 0.203: U$8.P$3 38.76,58.43 38.76,55.42 42.88,51.31 v43.56,51.31 | U$8.P$3 32.42,64.77 | U$8.P$3 31.15,66.04 26.67,66.04 25.4,64.77 25.4,63.5 26.67,62.23 26.67,60.96 25.4,59.69 25.4,59.03 24.37,58 U$5.P$1 v18.8,58 v18.79,57.99
D5  (via drill 0.51)
  Top 0.203: v50.16,31.11 v46.99,34.29 | v35.56,20.32 33.02,20.32 v31.55,18.85
  Top 0.254: U1.9 48.56,41.99 47.47,41.99 46.97,42.49 v45.07,42.49
  Bottom 0.203: v46.99,34.29 37.18,34.29 U$41.1 | v50.16,31.11 49.97,30.92 U$51.P$1 49.97,20.22 49.39,19.6 48.49,19.6 46.4,19.97 35.91,19.97 v35.56,20.32 | 31.74,15.9 U$10.P$1 31.74,18.66 v31.55,18.85
  Bottom 0.254: U$41.1 39.07,35.99 45.07,41.99 v45.07,42.49
D6  (via drill 0.51)
  Top 0.203: v52.51,19.61 50.87,17.95 43.78,17.95 v43.44,17.86
  Top 0.254: v50.07,44.29 U1.10
  Bottom 0.203: 52.07,33.99 51.65,33.99 | 53.34,33.99 52.49,33.99 U$51.P$4 52.49,19.66 v52.51,19.61 | 41.9,16.06 U$11.P$1 41.91,16.19 41.91,17.2 42.46,17.75 43.23,17.75 v43.44,17.86
  Bottom 0.254: v50.07,44.29 50.07,40.39 51.07,39.39 54.27,39.39 55.67,37.99 55.67,34.59 55.07,33.99 53.34,33.99 52.07,33.99 50.57,33.99 47.27,30.69 U$1.1
D7  (via drill 0.51)
  Top 0.203: U1.11 50.87,43.63 51.05,43.81 51.05,44.83 50.67,45.21 49.4,45.21 49.02,44.83 49.02,43.94 v48.13,43.05 | v48.64,38.61 48.13,38.1 48.13,34.92 51.31,31.75 v51.31,30.15 | v57.53,18.67 57.53,18.57 56.79,17.83 55.83,17.83 53.2,20.46 51.41,20.46 v50.79,19.93
  Top 0.305: U$33+.1 94.53,13.46 94.53,15.24 95.55,15.35 B1.+
  Bottom 0.203: U$33+.1 94.6,14.82 U$32.P$2 80.3,14.82 79.25,15.88 79.25,17.4 76.89,19.76 60.94,19.76 59.92,18.75 57.61,18.75 v57.53,18.67 | v48.13,43.05 48.13,39.12 v48.64,38.61 | v51.31,30.15 51.31,29.84 50.52,29.06 50.52,26.75 50.81,26.45 U$51.P$2 50.81,20.23 50.87,20.17 v50.79,19.93
D9  (via drill 0.51)
  Top 0.254: U1.13 52.47,43.89 v52.07,44.29
  Top 0.406: U$22.1 6.15,33.08 R3.1
  Bottom 0.203: U$22.1 10.3,37.17 U$20.P$3 25.06,37.17 25.4,36.83 25.7,36.14 arc11 28.1,31.91 28.1,25.1 33.86,19.33 46.63,19.33 46.97,19 | 56.87,33.02 55.88,33.02 53.33,30.47 U$51.P$5 53.34,20.32 53.34,19.26 52.03,17.95 48.02,17.95 46.97,19 | 46.97,19 46.97,18.96
  Bottom 0.254: v52.07,44.29 52.07,40.39 52.57,39.89 54.57,39.89 56.87,37.59 56.87,33.02 56.87,30.69 U$37.1
D10  (via drill 0.51)
  Top 0.203: v55.88,30.48 63.08,37.68
  Top 0.254: U$39.1 64.97,35.79 63.08,37.68 57.27,43.49 55.57,43.49 55.07,43.99 55.07,44.59 54.57,45.09 53.77,45.09 53.27,44.59 U1.14
  Top 0.406: 12.7,29.28 U$24.1 R4.1
  Bottom 0.203: U$24.1 R4.1 17.36,36.34 U$20.P$2 24.52,36.34 25.27,35.59 25.6,34.9 arc11 27.6,31.6 27.6,24.47 33.17,18.9 46.13,18.9 46.57,18.46 46.56,18.47 47.55,17.47 52.19,17.47 54.15,19.4 U$51.P$6 54.17,28.77 v55.88,30.48
D11  (via drill 0.51)
  Top 0.203: v51.56,28.7 v60.96,38.1 | v48.78,18.77 45.63,19.41 arc-40 30.11,28.8 26.45,28.8 v26.45,28.7
  Top 0.254: U1.15 54.07,44.09 v54.17,44.19
  Top 0.406: U$23.1 R5.1
  Bottom 0.203: U$4.1 73.52,45.86 | v60.96,38.1 60.96,44.59 | U$23.1 21.63,35.5 U$20.P$1 24.24,35.5 24.87,34.87 25.76,33.02 26.45,32.33 v26.45,28.7 | U$51.P$3 51.64,21.6 | v51.56,28.7 51.65,28.61 U$51.P$3 | U$51.P$3 51.65,19.48 51.06,18.89 48.88,18.89 v48.78,18.77
  Bottom 0.254: v54.17,44.19 54.57,44.59 60.96,44.59 68.72,44.59 68.73,44.6 U$4.1
D12  (via drill 0.51)
  Top 0.254: U1.16 56.36,42.7 PP-MISO.P$1
  other vias: 57.07,41.99
D13  (via drill 0.51)
  Top 0.254: PP-SCK.P$1 R1.2 59.87,45.64 59.42,45.19 59.42,44.59 59.02,44.19 U1.17
  other vias: 59.07,46.99
DTR  (via drill 0.51)
  Top 0.254: TP-DTR.P$1 58.42,56.44 JP2.1 59.37,53.99 60.02,54.64 C4.1
  other vias: 58.47,56.49
FTDI_VCC  (via drill 0.51)
  Top 0.254: S1.3 v54.57,36.99 S1.6 | C9.1 37.67,39.09 38.07,38.69 U4.4 39.12,37.74 39.62,37.24 44.82,37.24 v45.07,36.99 44.87,37.19 D4.A | JP2.4 50.8,56.46 v50.77,56.49
  Bottom 0.254: v45.07,36.99 47.07,36.99 | 47.07,36.99 v54.57,36.99 | 47.07,36.99 47.07,43.99 45.21,45.85 45.21,52.07 42.55,54.74 42.55,56.13 43.94,57.53 49.4,57.53 50.44,56.49 v50.77,56.49 TP1.P$1
GND  (via drill 0.51)
  Top 0.203: C10.2 C9.2 | S4.1 40.11,53.45 42.31,51.25 v42.31,50.49 43.16,49.64 43.92,49.64 | C2.C 62.82,44.82 D1.C | v63.34,46.99 61.69,46.99 C1.2 | v27.89,64.34 27.89,63.83 v25.65,61.59 27.32,59.93 27.32,59.62 arc17 24.56,51.57 24.38,50.67 24.38,43.81 24.56,42.79 arc20 28.09,33.02 28.09,31.9 v25.4,29.21 | 11.73,58.42 arc90 11.58,58.27 | v80.01,10.03 79.5,10.54 79.5,21.34 v79.76,21.59
  Top 0.254: U1.21 52.47,47.39 v52.07,46.99 51.67,46.59 49.07,46.59 | 49.07,46.59 U1.5 | 49.07,46.59 49.07,47.99 48.87,48.19 U1.3 47.07,48.19 46.47,48.79 46.47,48.99 45.82,49.64 C3.2 43.92,49.64 | U$43.1 PP-GND.P$1 37.31,53.45 S4.1 | v40.07,39.99 U4.2 | C2.C v63.34,46.99 | v40.07,39.99 41.42,39.99 42.07,40.64 R13.2 | C9.2 38.22,40.64 38.87,39.99 v40.07,39.99 | 42.07,44.99 Y1.2 | JP1.1 41.77,45.29 42.07,44.99 | v42.07,43.99 42.07,44.99 | JP2.6 45.72,56.44 v45.77,56.49 | JP2.5 v48.26,56.48 v48.27,56.49 | TEMP-.1 U2.3 90.89,59.52 90.64,59.27 C5.2 | S3.4 10.79,18.41 10.16,19.05 BUTTON-.1 | S2.2 12.7,10.52 12.47,10.29 10.29,10.29 8.89,8.89 | S2.5 12.7,7.36 12.57,7.49 10.29,7.49 8.89,8.89 | SLIDEOFF.1 8.89,8.89
  Top 0.305: R7.1 88.9,36.2 88.06,36.2 LIGHT-.1 | U$32-.1 87.44,16.49 B1.-
  Top 0.406: M1.P$2 8.51,54.06 D3.2 11.58,58.27 11.73,58.42 v12.7,58.42
  Bottom 0.203: U$43.1 33.38,57.06 33.38,61.45 U$8.P$5 | BUTTON-.1 U$42.P$1 0.66,19.06 | 7.2,8.93 SLIDEOFF.1 3.34,8.89 U$44.P$1 3.26,8.89 2.54,8.89 0.66,10.77 0.66,19.06 | U$8.P$5 | TEMP-.1 92.71,64.75 92.71,62.23 96.94,58 U$3.P$1 102.65,58 103.5,57.15 103.5,37.47 102.45,36.41 U$6.P$1 96.19,36.41 95.1,35.32 95.1,34.14 93.98,33.02 85.01,33.02 LIGHT-.1 82.03,36.01 U$33.P$3 80.71,36.01 79.5,34.8 79.5,21.84 v79.76,21.59 79.76,16.26 80.35,15.66 U$32.P$1 84.24,15.66 84.94,16.36 U$32-.1 | v25.65,61.59 25.65,60.88 24.79,60.02 24.79,59.46 24.17,58.84 U$5.P$2 13.12,58.84 v12.7,58.42 9.95,58.42 VIBE-.1 2.84,58.81 U$47.P$1 1.41,58.81 0.66,58.06 0.66,19.06 | U$8.P$5 30.05,64.77 29.21,64.77 28.78,64.34 v27.89,64.34 | 72.4,0.68 U$18.P$1 | 31.75,0.68 24.97,0.68 24.61,1.05 24.61,9.29 24.94,9.62 24.94,11.89 24.13,12.7 24.13,17.78 25.4,19.05 v25.4,29.21 | 31.75,0.68 41.91,0.68 | 41.91,0.68 52.07,0.68 | 52.07,0.68 62.23,0.68 | 62.23,0.68 72.4,0.68 | U$15.P$1 31.81,0.75 31.75,0.68 | U$16.P$1 41.97,0.75 41.91,0.68 | U$17.P$1 52.03,0.72 52.07,0.68 | 72.4,0.68 72.45,0.73 77.98,0.73 80.01,2.76 v80.01,10.03 | U$19.P$1 62.29,0.75 62.23,0.68
  Bottom 1: U$43.1 PP-GND.P$1
  pour Bottom (isolate 0.305): 52.07,22 arc-90 27.08,46.99 27.08,47.02 arc-90 52.04,71.98 52.07,71.98 arc-90 77.06,46.99 77.06,46.96 arc-90 52.1,22
  pour Top (isolate 0.381): 14.22,5.08 14.22,12.7 11.18,12.7 11.18,5.08
GRN
  Top 0.406: R5.2 14.85,35.63 13.35,35.63 13.35,35.33 D2.G
N$1
  Top 0.254: U1.7 46.97,44.99 45.77,46.19 Y1.1
N$2
  Top 0.203: R1.1 61.32,43.36 D1.A
N$3
  Top 0.254: U1.8 46.77,44.19 46.37,43.79 Y1.3
N$4
  pour Bottom (isolate 0.305): 101.47,58.39 101.47,58.52 arc90 91.52,68.48 91.26,68.48 arc90 81.48,58.7 81.48,58.39 arc90 91.52,48.36 arc90
N$7
  pour Bottom (isolate 0.305): 101.47,36.8 101.47,36.93 arc90 91.52,46.89 91.26,46.89 arc90 81.48,37.11 81.48,36.8 arc90 91.52,26.77 arc90
N$9
  pour Bottom (isolate 0.305): 101.47,15.21 101.47,15.34 arc90 91.52,25.3 91.26,25.3 arc90 81.48,15.52 81.48,15.21 arc90 91.52,5.18 arc90
N$10
  Top 0.406: D3.1 9.86,59.69 13.97,59.69 16.89,56.77 16.89,55.88 16.89,55.18 | 16.89,55.18 M1.P$1 | 16.89,55.18 R6.1
N$11
  pour Bottom (isolate 0.305): 22.73,58.39 22.73,58.52 arc90 12.78,68.48 12.52,68.48 arc90 2.74,58.7 2.74,58.39 arc90 12.78,48.36 arc90
N$13
  pour Bottom (isolate 0.305): 22.73,36.8 22.73,36.93 arc90 12.78,46.89 12.52,46.89 arc90 2.74,37.11 2.74,36.8 arc90 12.78,26.77 arc90
N$18
  Top 0.254: 61.15,9.08 61.21,9.02
  Top 0.406: LED.C 60.71,9.52 61.15,9.08 61.36,8.87 R.1
N$19
  Top 0.406: 62.23,13.97 LED+.1 63.71,12.36 LED.A
N$20
  Top 0.406: LED-.1 62.23,6.35 63.06,7.18 R.2
N$21
  Top 0.254: 71.31,9.08 71.37,9.02
  Top 0.406: LED1.C 70.87,9.52 71.31,9.08 71.52,8.87 R8.1
N$22
  Top 0.406: 72.39,13.97 LED+1.1 73.87,12.36 LED1.A
N$23
  Top 0.406: LED-1.1 72.39,6.35 73.22,7.18 R8.2
N$24
  Top 0.254: 50.99,9.08 51.05,9.02
  Top 0.406: LED2.C 50.55,9.52 50.99,9.08 51.2,8.87 R9.1
N$25
  Top 0.406: 52.07,13.97 LED+2.1 53.55,12.36 LED2.A
N$26
  Top 0.406: LED-2.1 52.07,6.35 52.9,7.18 R9.2
N$27
  Top 0.254: 40.83,9.08 40.89,9.02
  Top 0.406: LED3.C 40.39,9.52 40.83,9.08 41.04,8.87 R10.1
N$28
  Top 0.406: 41.91,13.97 LED+3.1 43.39,12.36 LED3.A
N$29
  Top 0.406: LED-3.1 41.91,6.35 42.74,7.18 R10.2
N$30
  Top 0.254: 30.67,9.08 30.73,9.02
  Top 0.406: LED4.C 30.23,9.52 30.67,9.08 30.88,8.87 R11.1
N$31
  Top 0.406: 31.75,13.97 LED+4.1 33.23,12.36 LED4.A
N$32
  Top 0.406: LED-4.1 31.75,6.35 32.58,7.18 R11.2
N$33
  Top 0.203: R12.2 44.57,40.29 44.87,40.59 D4.C
PROG
  Top 0.254: 41.42,38.69 U4.5 42.17,38.69 42.47,38.99 R13.1
RED
  Top 0.406: R3.2 11.15,35.93 11.15,36.33 11.65,36.83 12.9,36.83 13.4,37.33 D2.R
RST  (via drill 0.51)
  Top 0.254: R2.1 62.72,54.64 61.42,53.34 C4.2 60.3,52.57 v59.77,52.57 | U1.29 51.67,50.49 51.77,50.39 51.77,49.39 51.57,49.19 51.57,48.49 51.07,47.99 v50.07,47.99 | PP-RST.P$1 42.07,55.99 42.69,55.37 v43.69,55.37 42.98,54.66 S4.3
  Bottom 0.254: v43.69,55.37 43.69,54.86 45.97,52.58 45.97,50.55 48.53,47.99 v50.07,47.99 55.07,47.99 59.17,52.09 59.65,52.57 v59.77,52.57
  other vias: 41.07,55.99
RXI  (via drill 0.51)
  Top 0.254: v50.87,49.89 U1.30 | JP2.3 53.34,56.46 TP-RX.P$1
  Bottom 0.254: v50.87,49.89 50.87,53.99 TP-RX.P$1
  other vias: 53.37,56.49
SINK1
  pour Top (isolate 0.381): 10.16,5.08 10.16,8.89 7.62,8.89 arc-223 6.73,8.38 6.73,8 7.06,6.86 7.54,5.84 8.13,5.08
SINK2
  pour Top (isolate 0.381): 10.16,10.16 10.16,12.7 8,12.7 7.37,11.56 6.86,10.29 6.73,9.65 8.76,9.14
STAT
  Top 0.254: R12.1 43.67,41.09 43.37,41.39 41.12,41.39 U4.1
TXO  (via drill 0.51)
  Top 0.254: U1.31 50.07,51.99 49.57,52.49 49.57,57.19 50.17,57.79 55.07,57.79 55.87,56.99 TP-TX.P$1 JP2.2
  other vias: 55.87,56.49
VBATT
  Top 0.254: S1.4 S1.1 47.15,41.12 46.67,41.59 44.17,41.59 43.07,42.69 39.12,42.69 | JP1.2 39.07,47.99 38.77,47.69 38.77,44.99 39.12,44.64 39.12,42.69 | C10.1 36.47,41.19 36.67,41.39 39.02,41.39 U4.3 39.12,42.69
VCC  (via drill 0.51)
  Top 0.203: v56.08,18.87 55.55,18.87 53.47,20.95 50.37,20.95 49.93,20.51 49.93,19.82 49.7,19.6 49.18,19.6 49.15,19.6 48.51,19.6 48.49,19.62 47.57,19.79 arc-49 29.34,31.15 arc26 v28.9,31.41 | v29.84,63.45 arc-14 v31.2,64.8
  Top 0.254: 46.77,47.49 46.77,46.09 47.07,45.79 U1.6 v53.27,45.79 55.07,45.79 | 46.77,47.49 46.77,47.69 46.12,48.34 C3.1 44.92,48.34 44.27,48.99 41.07,48.99 v40.07,49.99 | U1.4 46.87,47.39 46.77,47.49 | S1.5 S1.2 53.24,41.12 v53.27,41.09 | 62.07,49.59 C2.A | 62.07,49.59 v62.07,50.29 | 62.07,49.59 62.02,49.64 C1.1 58.22,49.64 57.77,49.19 57.77,47.09 57.27,46.59 U1.20 55.27,46.59 55.07,46.39 55.07,45.79 | v63.07,52.09 R2.2 | U1.18 55.37,44.99 55.07,45.29 55.07,45.79 | TEMP+.1 87.64,54.62 88.9,55.88 C5.1 90.34,57.57 U2.1 | 91.53,35.05 v93.47,35.05 95.97,35.05 LIGHT+.1
  Top 0.305: 91.53,35.05 U3.COLLECTOR
  Top 0.406: D2.A 12,39.94 12.7,40.64 U$25.1 12.7,44.45 | U2.1 90.44,57.42
  Bottom 0.203: v40.07,49.99 40.07,51.37 38.1,53.34 38.1,57.9 U$8.P$4 v31.2,64.8 | U$20.P$4 22.77,38.01 | U$33.P$2 92.33,36.84 93.47,35.7 v93.47,35.05 | U$33.P$2 81.11,36.83 | 56.82,19.53 arc57 77.55,36.3 77.83,36.99 78,37.49 arc39 78.36,55.93 77.75,57.61 arc10 76.34,60.61 76.34,61.3 76.83,61.78 78,61.78 78.94,60.85 78.94,59.24 80.17,58 U$2.P$2 81.78,58 84.84,54.94 TEMP+.1 | 56.82,19.53 56.08,18.97 v56.08,18.87 | 25.58,38.41 arc-57 v29.84,63.45 | U$20.P$4 25.13,38.01 25.58,38.41 | U$33.P$2 79.79,36.84 78.69,35.74 77.98,35 arc-40 66.6,22.2 66.42,22.02 66.42,20.85 65.81,20.24 64.39,20.24 63.14,21.49 62.36,21.16 arc-13 56.82,19.53 | U$20.P$4 21.27,38.01 20.95,37.69 15.65,37.69 12.7,40.64 U$25.1 | 25.58,38.41 arc12 28.78,32.02 28.95,31.84 v28.9,31.41
  Bottom 0.254: v53.27,45.79 v53.27,41.09 | v63.07,52.09 63.07,51.29 v62.07,50.29 | v40.07,49.99 40.07,48.99 35.67,44.59 U$45.1

### Text on the board
Bottom: v34
tPlace: + | A4 | - | - | A5 | A3 | 3 | A1 | + | S | A2 | - | B | G | + | 11 | + | S | 9 | On | Off | 10 | A6 | R | 11 | 11 | 5 | 10 | - | + | 9 | G | B | 10 | 6 | 9 | S | A5 | - | 5 | 6 | A2 | A4 | A3 | - | 7 | + | + | + | + | + | Off | On | + | 2 | - | - | - | - | - | Released under the Creative Commons Attribution Share-Alike 3.0 License | http://creativecommons.org/licenses/by-sa/3.0 | L. Buechley | N. Seidle | P. Lewis